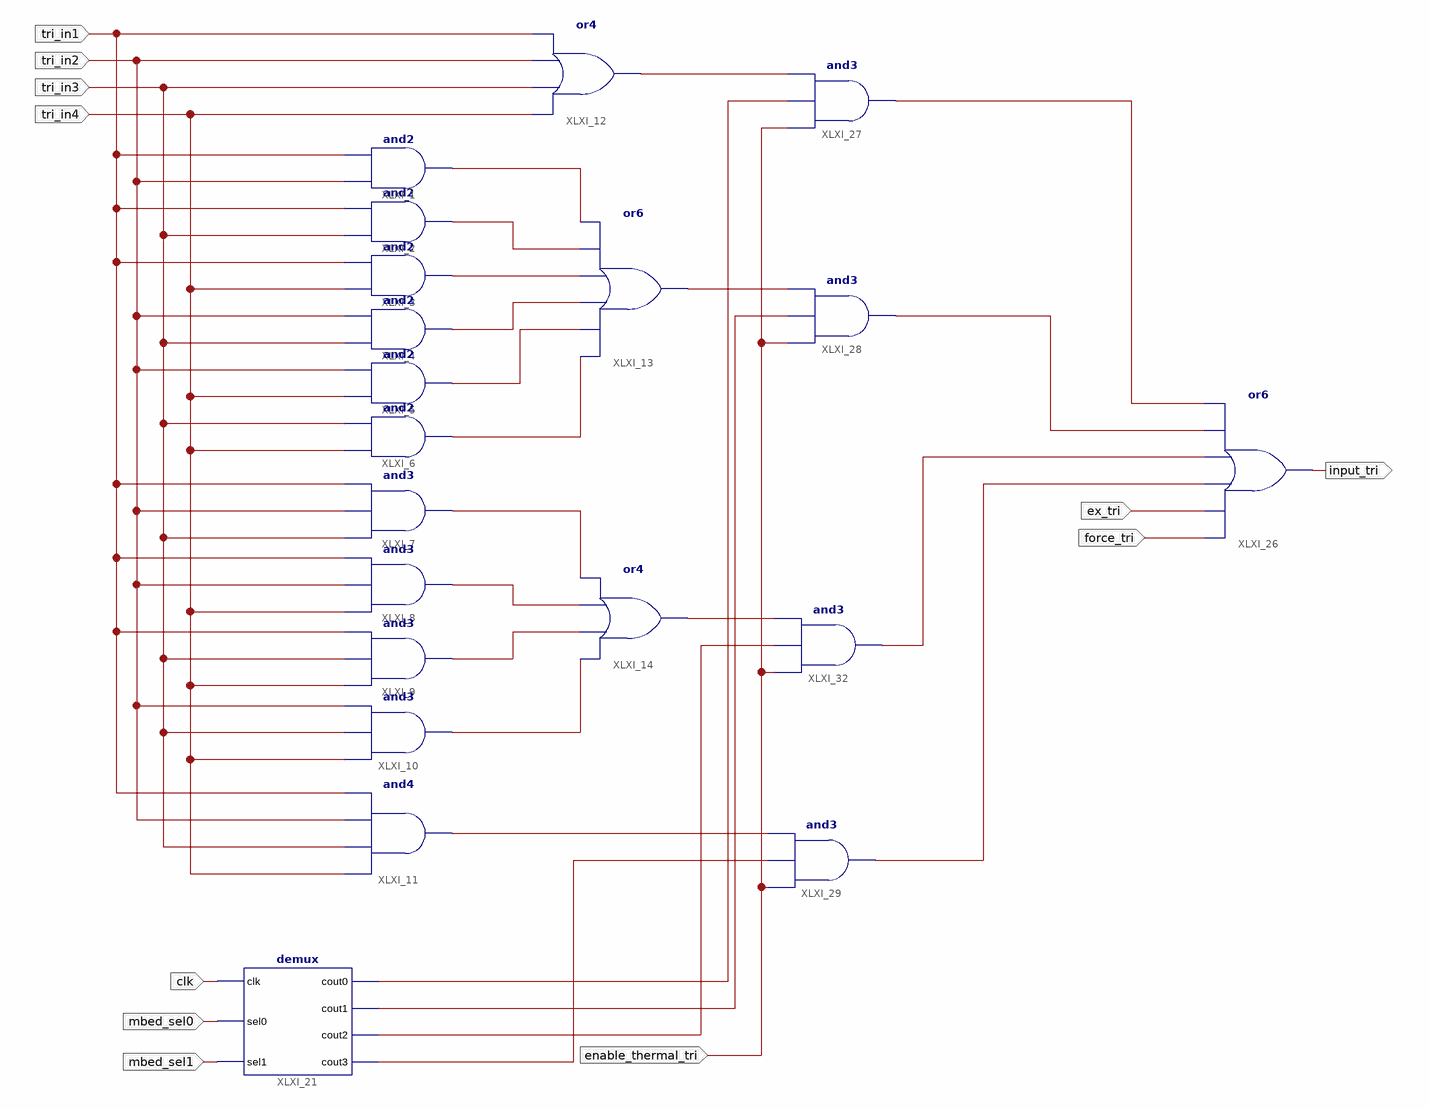
[diagram p0: schematic sheet 1]
// Xilinx ISE schematic majority_logic.sch (spartan3a) as structural Verilog: 20 symbols, 11 ports
module majority_logic (
  input  tri_in1,
  input  tri_in2,
  input  tri_in3,
  input  tri_in4,
  input  clk,
  input  mbed_sel0,
  input  mbed_sel1,
  input  enable_thermal_tri,
  input  ex_tri,
  input  force_tri,
  output input_tri
);

  wire XLXN_5, XLXN_6, XLXN_7, XLXN_8, XLXN_9, XLXN_10, XLXN_11, XLXN_12, XLXN_13, XLXN_14, XLXN_15, XLXN_16,
       XLXN_18, XLXN_19, XLXN_21, XLXN_22, XLXN_23, XLXN_36, XLXN_56, XLXN_66, XLXN_67, XLXN_69;

  or XLXI_12 (XLXN_5, tri_in4, tri_in3, tri_in2, tri_in1);
  or XLXI_13 (XLXN_6, XLXN_12, XLXN_11, XLXN_10, XLXN_9, XLXN_8, XLXN_7);
  or XLXI_14 (XLXN_67, XLXN_16, XLXN_15, XLXN_14, XLXN_13);
  demux XLXI_21 (
    .clk(clk), .sel0(mbed_sel0), .sel1(mbed_sel1), .cout0(XLXN_19), .cout1(XLXN_69), .cout2(XLXN_21),
    .cout3(XLXN_22));
  and XLXI_3 (XLXN_9, tri_in4, tri_in1);
  and XLXI_4 (XLXN_10, tri_in3, tri_in2);
  and XLXI_5 (XLXN_11, tri_in4, tri_in2);
  and XLXI_6 (XLXN_12, tri_in4, tri_in3);
  and XLXI_2 (XLXN_8, tri_in3, tri_in1);
  and XLXI_1 (XLXN_7, tri_in2, tri_in1);
  and XLXI_7 (XLXN_13, tri_in3, tri_in2, tri_in1);
  and XLXI_8 (XLXN_14, tri_in4, tri_in2, tri_in1);
  and XLXI_9 (XLXN_15, tri_in4, tri_in3, tri_in1);
  and XLXI_10 (XLXN_16, tri_in4, tri_in3, tri_in2);
  and XLXI_11 (XLXN_18, tri_in4, tri_in3, tri_in2, tri_in1);
  and XLXI_27 (XLXN_23, enable_thermal_tri, XLXN_19, XLXN_5);
  and XLXI_28 (XLXN_66, enable_thermal_tri, XLXN_69, XLXN_6);
  and XLXI_29 (XLXN_56, enable_thermal_tri, XLXN_22, XLXN_18);
  or XLXI_26 (input_tri, force_tri, ex_tri, XLXN_56, XLXN_36, XLXN_66, XLXN_23);
  and XLXI_32 (XLXN_36, enable_thermal_tri, XLXN_21, XLXN_67);
endmodule
